# Altium schematic sheet MAIN_Schematic.SchDoc
size A3; SheetNumber: 1; SheetTotal: 2
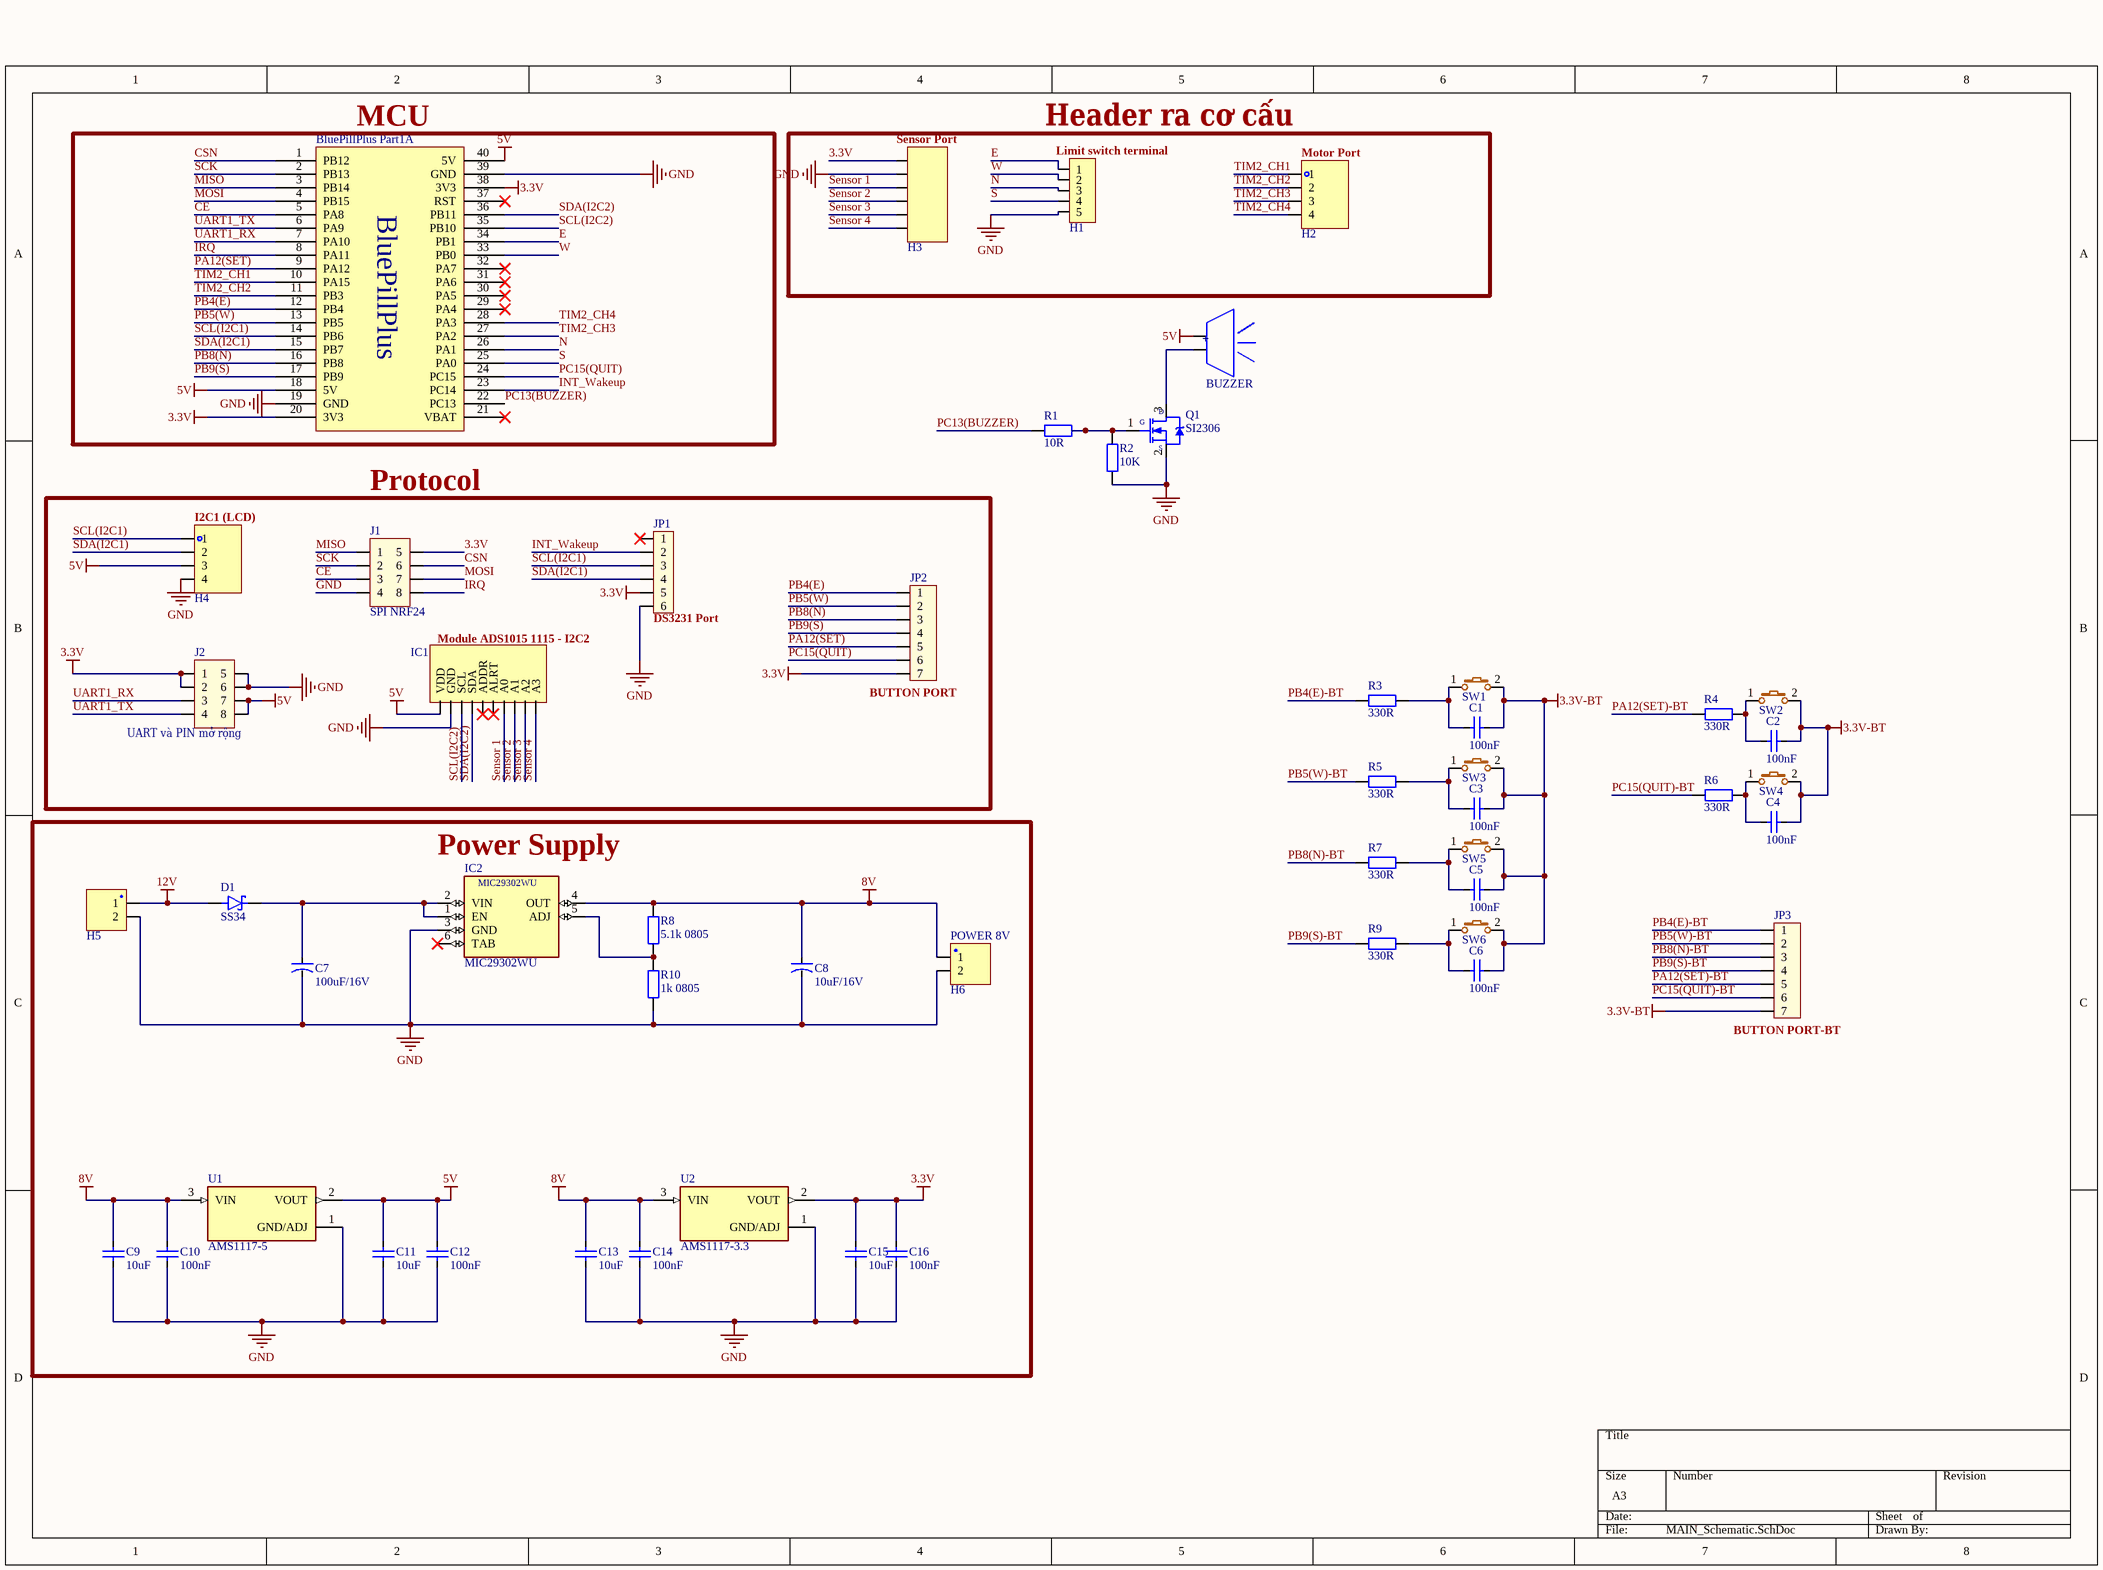
[diagram p0: MAIN_Schematic.SchDoc]

## Parts
BluePillPlus_Part1  U?  [BluePillPlus]  (value not drawn)  (part A of 2)
BUZZER  Buzzer  [Buzzer 9mm]  (value not drawn)
C1  100nF  [CAP_0805]
C2  100nF  [CAP_0805]
C3  100nF  [CAP_0805]
C4  100nF  [CAP_0805]
C5  100nF  [CAP_0805]
C6  100nF  [CAP_0805]
C7  100uF/16V  [CA-ALU-5]
C8  10uF/16V  [CA-ALU-5]
C9  10uF  [CAP_0805]
C10  100nF  [CAP_0805]
C11  10uF  [CAP_0805]
C12  100nF  [CAP_0805]
C13  10uF  [CAP_0805]
C14  100nF  [CAP_0805]
C15  10uF  [CAP_0805]
C16  100nF  [CAP_0805]
D1  SS34  [DIOM4325X244N]
H1  Limit switch terminal  [Header 5P 5.08]
H2  Motor Port  [Header 4P 5.08]
H3  Sensor Port  [Header 6P 5.08]
H4  I2C1 (LCD)  [XH2.54 4P]
H5  Header 2P  [KF128-5.0-2P]  (value not drawn)
H6  POWER 8V  [KF128-5.0-2P]
IC1  Module ADS1015 1115 - I2C2  [ADS1015 1115]
IC2  MIC29302WU  [TO263-5]
J1  SPI NRF24  [JP4-C2T]
J2  UART và PIN mở rộng  [JP4x2]
JP1  DS3231 Port  [JP6-C1T]
JP2  BUTTON PORT  [Header7]
JP3  BUTTON PORT-BT  [Header7]
Q1  SI2306  [SOT23]
R1  10R  [RES-SMD-0805]
R2  10K  [RES-SMD-0805]
R3  330R  [RES-SMD-0805]
R4  330R  [RES-SMD-0805]
R5  330R  [RES-SMD-0805]
R6  330R  [RES-SMD-0805]
R7  330R  [RES-SMD-0805]
R8  5.1k 0805  [RES-SMD-0805]
R9  330R  [RES-SMD-0805]
R10  1k 0805  [RES-SMD-0805]
SW1  Nut nhan 7mm  [BUTTON 4 PIN]  (value not drawn)
SW2  Nut nhan 7mm  [BUTTON 4 PIN]  (value not drawn)
SW3  Nut nhan 7mm  [BUTTON 4 PIN]  (value not drawn)
SW4  Nut nhan 7mm  [BUTTON 4 PIN]  (value not drawn)
SW5  Nut nhan 7mm  [BUTTON 4 PIN]  (value not drawn)
SW6  Nut nhan 7mm  [BUTTON 4 PIN]  (value not drawn)
U1  AMS1117-5  [SOT229P700X180-4N]
U2  AMS1117-3.3  [SOT229P700X180-4N]

## Blocks framed on the sheet
MCU: BluePillPlus_Part1
Header ra cơ cấu: H1-H3
Protocol: H4 IC1 J1 J2 JP1 JP2
Power Supply: C7-C16 D1 H5 H6 IC2 R8 R10 U1 U2

## Nets
3.3V: BluePillPlus_Part1.20(3V3) BluePillPlus_Part1.38(3V3) C15.2 C16.2 H3.1 J1.5 J2.1 J2.2 JP1.5 JP2.7 U2.2(VOUT)
3.3V-BT: C1.2 C2.2 C3.2 C4.2 C5.2 C6.2 JP3.7 SW1.2 SW2.2 SW3.2 SW4.2 SW5.2 SW6.2
5V: BluePillPlus_Part1.18(5V) BluePillPlus_Part1.40(5V) BUZZER.1 C11.2 C12.2 H4.3 IC1.1(VDD) J2.7 J2.8 U1.2(VOUT)
8V: C8.1 C9.2 C10.2 C13.2 C14.2 H6.1 IC2.4(OUT) R8.1 U1.3(VIN) U2.3(VIN)
12V: D1.A H5.1
GND: BluePillPlus_Part1.19(GND) BluePillPlus_Part1.39(GND) C7.2 C8.2 C9.1 C10.1 C11.1 C12.1 C13.1 C14.1 C15.1 C16.1 H1.5 H3.2 H4.4 H5.2 H6.2 IC1.2(GND) IC2.3(GND) J1.4 J2.5 J2.6 JP1.6 Q1.2(S) R2.2 R10.2 U1.1(GND/ADJ) U2.1(GND/ADJ)
CE: BluePillPlus_Part1.5(PA8) J1.3
CSN: BluePillPlus_Part1.1(PB12) J1.6
E: BluePillPlus_Part1.34(PB1) H1.1
INT_Wakeup: BluePillPlus_Part1.23(PC14) JP1.2
IRQ: BluePillPlus_Part1.8(PA11) J1.8
MISO: BluePillPlus_Part1.3(PB14) J1.1
MOSI: BluePillPlus_Part1.4(PB15) J1.7
N: BluePillPlus_Part1.26(PA1) H1.3
PA12(SET): BluePillPlus_Part1.9(PA12) JP2.5
PA12(SET)-BT: JP3.5 R4.2
PB4(E): BluePillPlus_Part1.12(PB4) JP2.1
PB4(E)-BT: JP3.1 R3.2
PB5(W): BluePillPlus_Part1.13(PB5) JP2.2
PB5(W)-BT: JP3.2 R5.2
PB8(N): BluePillPlus_Part1.16(PB8) JP2.3
PB8(N)-BT: JP3.3 R7.2
PB9(S): BluePillPlus_Part1.17(PB9) JP2.4
PB9(S)-BT: JP3.4 R9.2
PC13(BUZZER): BluePillPlus_Part1.22(PC13) R1.1
PC15(QUIT): BluePillPlus_Part1.24(PC15) JP2.6
PC15(QUIT)-BT: JP3.6 R6.2
S: BluePillPlus_Part1.25(PA0) H1.4
SCK: BluePillPlus_Part1.2(PB13) J1.2
SCL(I2C1): BluePillPlus_Part1.14(PB6) H4.1 JP1.3
SCL(I2C2): BluePillPlus_Part1.35(PB10) IC1.3(SCL)
SDA(I2C1): BluePillPlus_Part1.15(PB7) H4.2 JP1.4
SDA(I2C2): BluePillPlus_Part1.36(PB11) IC1.4(SDA)
Sensor 1: H3.3 IC1.7(A0)
Sensor 2: H3.4 IC1.8(A1)
Sensor 3: H3.5 IC1.9(A2)
Sensor 4: H3.6 IC1.10(A3)
TIM2_CH1: BluePillPlus_Part1.10(PA15) H2.1
TIM2_CH2: BluePillPlus_Part1.11(PB3) H2.2
TIM2_CH3: BluePillPlus_Part1.27(PA2) H2.3
TIM2_CH4: BluePillPlus_Part1.28(PA3) H2.4
UART1_RX: BluePillPlus_Part1.7(PA10) J2.3
UART1_TX: BluePillPlus_Part1.6(PA9) J2.4
W: BluePillPlus_Part1.33(PB0) H1.2
NetBUZZER_2: BUZZER.2 Q1.3(D)
NetC1_1: C1.1 R3.1 SW1.1
NetC2_1: C2.1 R4.1 SW2.1
NetC3_1: C3.1 R5.1 SW3.1
NetC4_1: C4.1 R6.1 SW4.1
NetC5_1: C5.1 R7.1 SW5.1
NetC6_1: C6.1 R9.1 SW6.1
NetC7_1: C7.1 D1.C(K) IC2.1(EN) IC2.2(VIN)
NetIC2_5: IC2.5(ADJ) R8.2 R10.1
NetQ1_1: Q1.1(G) R1.2 R2.1

Not connected (* = marked no-connect by the designer): BluePillPlus_Part1 21(VBAT)* 29(PA4)* 30(PA5)* 31(PA6)* 32(PA7)* 37(RST)*; IC1 5(ADDR)* 6(ALRT)*; IC2 6(TAB)*; JP1 1*

## Notes on the sheet
- (in symbol Buzzer) +

## Library data of the parts
BluePillPlus_Part1 = BluePillPlus: ComponentLink1Description: WeAct Studio; ComponentLink1URL: WeAct-TC.cn; ComponentLink2Description: BluePillPlus Github; ComponentLink2URL: https://github.com/WeActTC/BluePill-Plus; ComponentLink3Description: BluePillPlus Gitee; ComponentLink3URL: https://gitee.com/WeAct-TC/BluePill-Plus
BUZZER = Buzzer: spk buzz coi loa
C1-C6 C9-C16 = CapSMD: Capacitor; Value: 33p; Published: 8-Jun-2000; LatestRevisionDate: 17-Jul-2002; LatestRevisionNote: Re-released for DXP Platform.; PackageReference: RAD-0.3; Publisher: Altium Limited
C7 C8 = CAP-ALU-DIP: Capacitor (Semiconductor SIM Model); Value: 104; LatestRevisionDate: 17-Jul-2002; LatestRevisionNote: Re-released for DXP Platform.; PackageReference: C1206; Publisher: Altium Limited
D1 = SSB44: 4A, 40V, Schottky Rectifier; MF: Taiwan Semiconductor; SnapEDA_Link: https://www.snapeda.com/parts/SSB44/Taiwan+Semiconductor/view-part/?ref=snap; Package: SMB-2 Taiwan Semiconductor; Value: *; MP: SSB44; Check_prices: https://www.snapeda.com/parts/SSB44/Taiwan+Semiconductor/view-part/?ref=eda
H1 = Header 5P
H2 H4 = Header 4P
H3 = Header 6P
H6 = Header 2P
IC1 = Module ADS1015 1115: Module ADS1015 1115 ADC 12Bit 16Bit
IC2 = MIC29302WU: Linear Voltage Regulator IC 1 Output 3A TO-263-5; MF: Microchip Technology; Package: TO-263-6 Microchip Technology; Price: None; MP: MIC29302WU; Availability: Unavailable; SnapEDA_Link: https://www.snapeda.com/parts/MIC29302WU/Microchip/view-part/4422516/?ref=snap; Value: *
J1 J2 = JP4x2: Connector 4x2; Value: Connector 4x2
JP1 = JP6: JP6 PIN; Value: JP7
JP2 JP3 = Header7: Connector 7; Value: Connector 7
Q1 = SI2304: SI2306 N-Mosfet 3.5A 30V SOT-23
R1-R10 = Resistor - SMD: Resistor SMD; Manufacturer: Generic Components; Class: Passive; Published: 08/06/2000; Publisher: Altium Hobart Technology Centre
SW1-SW6 = Button
U1 U2 = AMS1117-5.0: 1A LOW DROPOUT VOLTAGE REGULATOR; MF: ams; MP: AMS1117-5.0; Package: SOT-223 Seeed Technology; SnapEDA_Link: https://www.snapeda.com/parts/AMS1117-5.0/ams/view-part/?ref=snap; Check_prices: https://www.snapeda.com/parts/AMS1117-5.0/ams/view-part/?ref=eda; Availability: Not in stock; Value: *; Price: None